# EAGLE design PCM1794 (EAGLE 6.5.0)
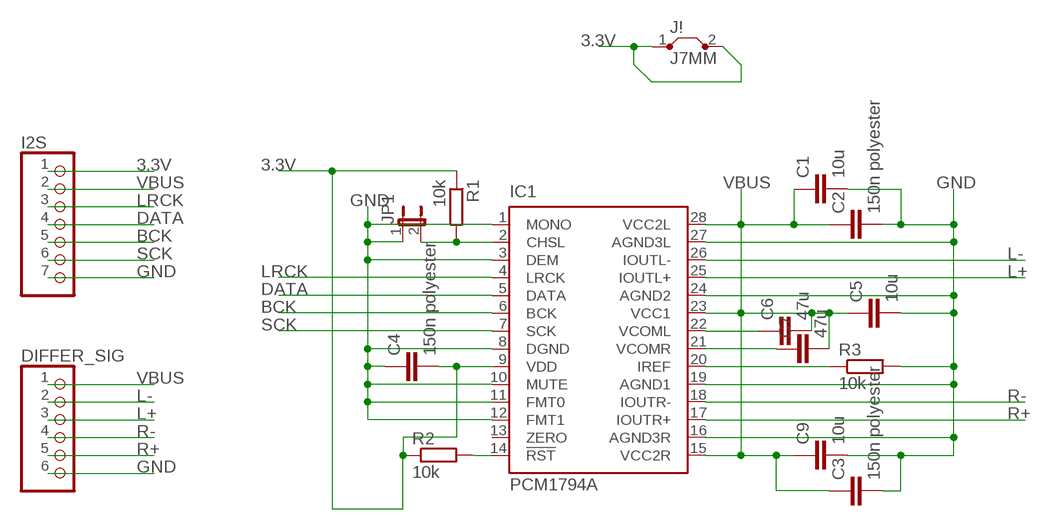
[diagram p0: schematic, sheet 1]

## Parts
C1  10u  C-EU025-050X050  [C025-050X050]
C2  150n polyester  C7.5/4  [C7.5B4]
C3  150n polyester  C7.5/4  [C7.5B4]
C4  150n polyester  C7.5/4  [C7.5B4]
C5  10u  C-EU025-050X050  [C025-050X050]
C6  47u  C-EU025-050X050  [C025-050X050]
C7  47u  C-EU025-050X050  [C025-050X050]
C9  10u  C-EU025-050X050  [C025-050X050]
DIFFER_SIG  PINHD-1X6/90  [1X06/90]
I2S  PINHD-1X7  [1X07]
IC1  PCM1794A  [DB_R-PDSO-G28]
J!  J7MM  [07]
JP1  JP1E  [JP1]
R1  10k  R-EU_0207/7  [0207/7]
R2  10k  R-EU_0207/7  [0207/7]
R3  10k  R-EU_0207/7  [0207/7]

## Nets
3.3V: C4.2 I2S.1 IC1.9(VDD) J!.1 J!.2 R1.1 R2.1
BCK: I2S.5 IC1.6(BCK)
DATA: I2S.4 IC1.5(DATA)
GND: C1.2 C2.2 C3.2 C4.1 C5.2 C9.2 DIFFER_SIG.6 I2S.7 IC1.1(MONO) IC1.3(DEM) IC1.8(DGND) IC1.10(MUTE) IC1.11(FMT0) IC1.12(FMT1) IC1.16(AGND3R) IC1.19(AGND1) IC1.24(AGND2) IC1.27(AGND3L) JP1.1 R3.2
L+: DIFFER_SIG.3 IC1.25(IOUTL+)
L-: DIFFER_SIG.2 IC1.26(IOUTL-)
LRCK: I2S.3 IC1.4(LRCK)
N$1: C6.1 IC1.22(VCOML)
N$2: C7.1 IC1.21(VCOMR)
N$3: IC1.2(CHSL) JP1.2 R1.2
N$5: IC1.20(IREF) R3.1
N$6: IC1.14(!RST) R2.2
R+: DIFFER_SIG.5 IC1.17(IOUTR+)
R-: DIFFER_SIG.4 IC1.18(IOUTR-)
SCK: I2S.6 IC1.7(SCK)
VBUS: C1.1 C2.1 C3.1 C5.1 C6.2 C7.2 C9.1 DIFFER_SIG.1 I2S.2 IC1.15(VCC2R) IC1.23(VCC1) IC1.28(VCC2L)
Unconnected: IC1.13(ZERO)

## Library data of the parts
C1 C5-C7 C9 = rcl:C-EU: CAPACITOR, European symbol
C2-C4 = capacitor-wima:C: CAPACITOR naming: grid - package width
DIFFER_SIG = pinhead:PINHD-1X6: PIN HEADER
I2S = pinhead:PINHD-1X7: PIN HEADER
IC1 = custom:PCM1794A: 24-BIT, 192-kHz SAMPLING, ADVANCED SEGMENT, AUDIO STEREO DIGITAL-TO-ANALOG CONVERTER Source: http://focus.ti.com/lit/ds/symlink/pcm1792.pdf; MF: TEXAS INSTRUMENTS; MPN: PCM1792DB; OC_FARNELL: 1207081; OC_NEWARK: 61H5171
J! = jumper:J: Bridge
JP1 = jumper:JP1E: JUMPER
R1-R3 = rcl:R-EU_: RESISTOR, European symbol

## Board
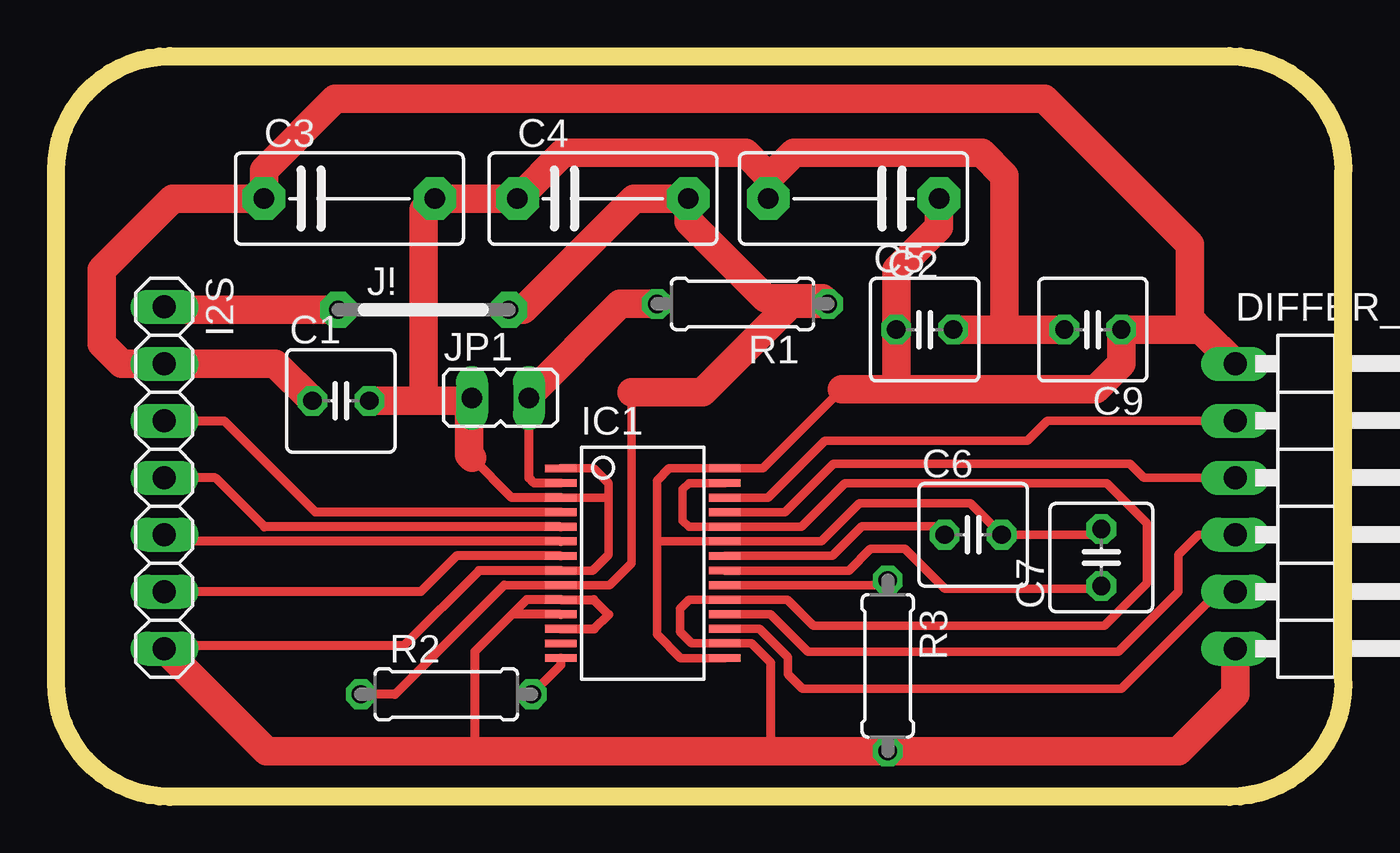
[diagram p1: board, top side]

Size 57.4 x 33.02 mm. Coordinates in mm from the lower left corner, seen from the top.
Outline: 5.08,33.02 52.32,33.02 arc-90 57.4,27.94 57.4,5.08 arc-90 52.32,0 5.08,0 arc-90 0,5.08 0,27.94 arc-90 5.08,33.02
Copper layers (1*16): Top 0.035mm / dielectric 1.5mm / Bottom 0.035mm
Design rules "default": minimum track width 10mil, minimum drill 24mil, track to track 8mil, track to pad 8mil, pad to pad 8mil, via to via 8mil, smd to smd 8mil, copper to edge 40mil, drill to drill 8mil, minimum pad ring 10mil, minimum via ring 8mil, stop-mask expansion 4mil, vias tented up to drill 0mil, thermal gap 10mil

### Footprints (pad centres in the part's own frame; a part is rotated, then mirrored left to right if it is on the bottom)
C025-050X050 = drill 0.813 octagon: 1 -1.27,0; 2 1.27,0
C7.5B4 = drill 0.914 pad 1.905 octagon: 1 -3.81,0; 2 3.81,0
1X06/90 = drill 1.016 long: 1 -6.35,-3.81; 2 -3.81,-3.81; 3 -1.27,-3.81; 4 1.27,-3.81; 5 3.81,-3.81; 6 6.35,-3.81
1X07 = drill 1.016 long: 1 -7.62,0; 2 -5.08,0; 3 -2.54,0; 4 0,0; 5 2.54,0; 6 5.08,0; 7 7.62,0
DB_R-PDSO-G28 = smd 0.348 x 1.397: 1 -4.225,-3.656; 2 -3.575,-3.656; 3 -2.925,-3.656; 4 -2.275,-3.656; 5 -1.625,-3.656; 6 -0.975,-3.656; 7 -0.325,-3.656; 8 0.325,-3.656; 9 0.975,-3.656; 10 1.625,-3.656; 11 2.275,-3.656; 12 2.925,-3.656; 13 3.575,-3.656; 14 4.225,-3.656; 15 4.225,3.656; 16 3.575,3.656; 17 2.925,3.656; 18 2.275,3.656; 19 1.625,3.656; 20 0.975,3.656; 21 0.325,3.656; 22 -0.325,3.656; 23 -0.975,3.656; 24 -1.625,3.656; 25 -2.275,3.656; 26 -2.925,3.656; 27 -3.575,3.656; 28 -4.225,3.656
07 = drill 0.813 pad 1.6 octagon: 1 -3.81,0; 2 3.81,0
JP1 = drill 0.914 long: 1 0,-1.27; 2 0,1.27
0207/7 = drill 0.813 octagon: 1 -3.81,0; 2 3.81,0

### Placement (x,y rotation side)
C1  12.7,17.65 0 top
C2  35.56,26.67 180 top
C3  13.08,26.67 0 top
C4  24.38,26.67 0 top
C5  38.73,20.83 0 top
C6  40.89,11.68 0 top
C7  46.61,10.67 90 top
C9  46.23,20.83 180 top
DIFFER_SIG  56.39,12.95 270 top
I2S  4.83,14.22 270 top
IC1  26.16,10.41 270 top
J!  16.38,21.72 0 top
JP1  19.81,17.78 270 top
R1  30.61,21.97 180 top
R2  17.4,4.57 0 top
R3  37.08,5.84 270 top

### Tracks (layer width: path | path; a pad name or v marks a point on that pad's centre or on a via)
3.3V  (1 unrouted)
  Top 0.381: 19.98,9.44 IC1.9 24.68,9.44 25.65,10.41 25.65,18.03
  Top 0.406: 19.98,9.44 15.11,4.57 R2.1
  Top 1.27: 25.65,18.03 28.83,18.03 32.77,21.97 R1.1 34.16,22.22 31.62,22.22 28.19,25.65 C4.2 25.78,26.67 20.83,21.72 J!.2 | J!.1 4.95,21.72 I2S.1
BCK
  Top 0.406: IC1.6 5.12,11.39 I2S.5
DATA
  Top 0.406: IC1.5 9.3,12.04 7.11,14.22 I2S.4
GND
  Top 0.381: IC1.8 23.93,10.09 24.64,10.79 24.64,13.33 | IC1.1 23.97,14.64 24.64,13.97 24.64,13.33 | IC1.27 28.21,13.99 27.94,13.72 27.94,12.32 28.22,12.04 IC1.24 33.25,12.04 35.18,13.97 46.86,13.97 48.64,12.19 48.64,9.53 46.74,7.62 33.78,7.62 32.61,8.79 IC1.19 28.22,8.79 27.81,8.38 27.81,7.37 28.34,6.84 IC1.16 31.01,6.84 31.88,5.97 | IC1.3 24.63,13.34 24.64,13.33
  Top 0.406: 32,2.03 31.88,2.16 31.88,5.97 | IC1.8 18.85,10.09 15.49,6.73 4.95,6.73 I2S.7 | 20.33,8.14 20.98,8.79 IC1.10 23.98,8.79 24.64,8.13 24,7.49 IC1.12 | 18.54,2.03 18.67,2.16 18.67,6.48 20.33,8.14 | IC1.11 20.33,8.14 | IC1.3 20.32,13.34 18.54,15.11
  Top 1.27: C5.2 42.42,20.83 | 42.42,20.83 C9.2 | DIFFER_SIG.6 52.58,4.57 50.04,2.03 R3.2 32,2.03 18.54,2.03 9.4,2.03 I2S.7 | 42.42,20.83 42.29,20.95 42.29,27.69 41.27,28.7 32.89,28.7 31.75,27.56 C2.2 31.75,27.69 30.73,28.7 22.61,28.7 C4.1 C3.2 16.38,26.16 16.38,17.78 16.51,17.65 | C1.2 16.51,17.65 | 16.51,17.65 18.41,17.65 | 18.41,17.65 JP1.1 | 18.41,17.65 18.41,15.24 18.54,15.11
L+
  Top 0.381: IC1.25 32.5,12.69 34.67,14.86 47.88,14.86 48.51,14.22 DIFFER_SIG.3
L-
  Top 0.381: IC1.26 31.75,13.34 34.29,15.88 43.31,15.88 44.2,16.76 DIFFER_SIG.2
LRCK
  Top 0.406: I2S.3 7.49,16.76 11.57,12.69 IC1.4
N$1
  Top 0.381: IC1.22 34.62,10.74 35.94,12.06 39.24,12.06 C6.1
N$2
  Top 0.381: IC1.21 35.36,10.09 36.32,11.05 37.85,11.05 39.62,9.27 46.48,9.27 C7.1
N$3
  Top 0.406: IC1.2 21.32,13.99 21.08,14.22 JP1.2
  Top 1.27: JP1.2 21.08,17.91 25.15,21.97 R1.2
N$5
  Top 0.381: IC1.20 36.87,9.44 R3.1
N$6
  Top 0.406: IC1.14 22.51,5.87 R2.2
R+
  Top 0.381: IC1.17 31.37,7.49 32.64,6.22 32.64,5.46 33.27,4.83 47.5,4.83 51.82,9.14 DIFFER_SIG.5
R-
  Top 0.381: IC1.18 31.87,8.14 33.53,6.48 47.37,6.48 50.04,9.14 50.04,10.79 50.93,11.68 DIFFER_SIG.4
SCK
  Top 0.406: IC1.7 17.85,10.74 16.26,9.14 I2S.6
VBUS
  Top 0.381: IC1.28 27.97,14.64 | C7.2 46.35,11.68 C6.2 40.77,13.08 35.81,13.08 34.12,11.39 IC1.23 26.84,11.39 26.8,11.43 | IC1.28 31.53,14.64 35.05,18.16 | IC1.28 27.34,14.64 26.8,14.1 26.8,11.43 | 26.8,11.43 26.8,7.24 27.85,6.19 IC1.15
  Top 1.27: 51.05,20.83 C9.1 47.5,19.3 46.35,18.16 37.59,18.16 | 35.05,18.16 37.59,18.16 | 37.59,18.16 37.46,18.29 C5.1 37.46,23.5 39.37,25.4 C2.1 | 51.05,20.83 DIFFER_SIG.1 | 51.05,20.83 50.55,21.34 50.55,24.64 44.07,31.11 12.45,31.11 9.27,27.94 C3.1 5.21,26.67 2.03,23.5 2.03,20.19 2.92,19.3 I2S.2 9.78,19.3 C1.1